# EAGLE design hexapod_mk2_leg_v0.0 (EAGLE 9.6.2)
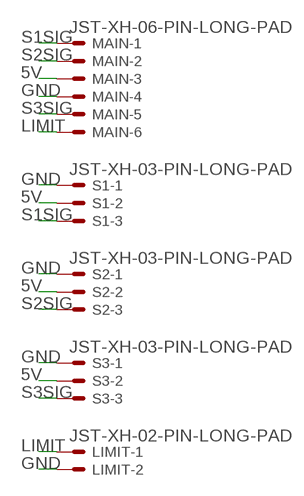
[diagram p0: schematic, sheet 1]

## Parts
LIMIT  JST-XH-02-PIN-LONG-PAD  [JST-XH-02-PACKAGE-LONG-PAD]
MAIN  JST-XH-06-PIN-LONG-PAD  [JST-XH-06-PACKAGE-LONG-PAD]
S1  JST-XH-03-PIN-LONG-PAD  [JST-XH-03-PACKAGE-LONG-PAD]
S2  JST-XH-03-PIN-LONG-PAD  [JST-XH-03-PACKAGE-LONG-PAD]
S3  JST-XH-03-PIN-LONG-PAD  [JST-XH-03-PACKAGE-LONG-PAD]

## Nets
5V: MAIN.3 S1.2 S2.2 S3.2
GND: LIMIT.2 MAIN.4 S1.1 S2.1 S3.1
LIMIT: LIMIT.1 MAIN.6
S1SIG: MAIN.1 S1.3
S2SIG: MAIN.2 S2.3
S3SIG: MAIN.5 S3.3

## Library data of the parts
LIMIT = Rembrandt Electronics - JST XH Connectors v1-0:JST-XH-02-PIN: JST XH Connector 2 Pin Wire to board connector. Pitch: 2,54 mm, (0.100") Number of pins: 2 Created by Rembrandt Electronics www.rembrandtelectronics.com
MAIN = Rembrandt Electronics - JST XH Connectors v1-0:JST-XH-06-PIN: JST XH Connector 2 Pin Wire to board connector. Pitch: 2,54 mm, (0.100") Number of pins: 6 Created by Rembrandt Electronics www.rembrandtelectronics.com
S1-S3 = Rembrandt Electronics - JST XH Connectors v1-0:JST-XH-03-PIN: JST XH Connector 2 Pin Wire to board connector. Pitch: 2,54 mm, (0.100") Number of pins: 3 Created by Rembrandt Electronics www.rembrandtelectronics.com

## Board
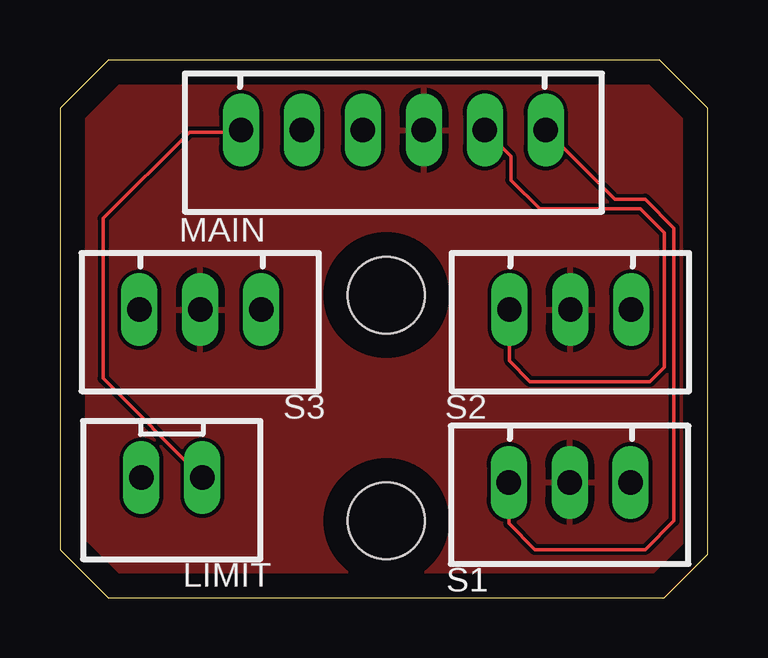
[diagram p1: board, top side]
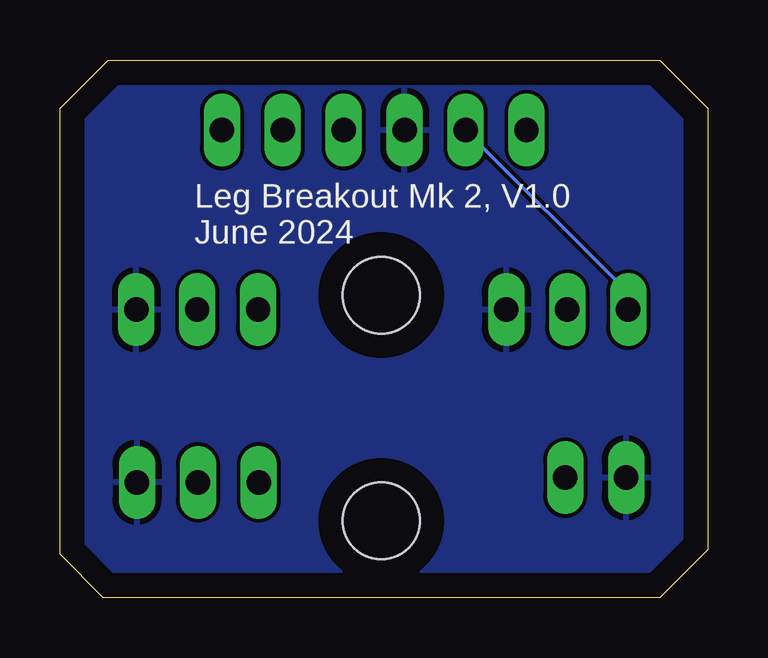
[diagram p2: board, bottom side, seen from below]

Size 27 x 22.4 mm. Coordinates in mm from the lower left corner, seen from the top.
Outline: 0,20.4 0,2 2,0 25.2,0 27,1.8 27,20.4 25,22.4 2,22.4 0,20.4
Copper layers (1*16): Top 0.035mm / dielectric 1.5mm / Bottom 0.035mm
Design rules "default": minimum track width 6mil, minimum drill 0.35mm, track to track 6mil, track to pad 6mil, pad to pad 6mil, via to via 6mil, smd to smd 6mil, copper to edge 40mil, drill to drill 6mil, minimum pad ring 10mil, minimum via ring 8mil, stop-mask expansion 4mil, vias tented up to drill 0mil, thermal gap 10mil
Holes 3.2 mm at 13.6,12.6 13.6,3.2

### Footprints (pad centres in the part's own frame; a part is rotated, then mirrored left to right if it is on the bottom)
JST-XH-02-PACKAGE-LONG-PAD = drill 1.016 long: 1 -1.27,0; 2 1.27,0
JST-XH-06-PACKAGE-LONG-PAD = drill 1.016 long: 1 -6.35,0; 2 -3.81,0; 3 -1.27,0; 4 1.27,0; 5 3.81,0; 6 6.35,0
JST-XH-03-PACKAGE-LONG-PAD = drill 1.016 long: 1 -2.54,0; 2 0,0; 3 2.54,0

### Placement (x,y rotation side)
LIMIT  4.66,5 180 top
MAIN  13.9,19.48 180 top
S1  21.25,4.8 180 top
S2  21.28,12 180 top
S3  5.85,12 180 top

### Tracks (layer width: path | path; a pad name or v marks a point on that pad's centre or on a via)
5V
  pour Top: 0.2,22 26.4,22 26.6,21.8 26.6,0.4 1,0.4 0.8,0.6 0.8,21.4
GND
  pour Bottom: 0.6,22.4 26.2,22.4 26.6,22 26.6,0.4 26.2,0 1.2,0 0.8,0.4 0.8,22.2
LIMIT
  Top 0.152: MAIN.6 7.47,19.4 5.4,19.4 1.8,15.8 1.8,9.13 LIMIT.1
S1SIG
  Top 0.152: MAIN.1 23.13,16.6 24.4,16.6 25.6,15.4 25.6,3.2 24.4,2 19.8,2 18.71,3.09 S1.3
S2SIG
  Top 0.152: MAIN.2 18.8,18.39 18.8,17.4 20,16.2 24.2,16.2 25.2,15.2 25.2,9.6 24.6,9 19.6,9 18.74,9.86 S2.3
S3SIG
  Bottom 0.152: S3.3 3.31,12.7 MAIN.5

### Text on the board
tPlace: ⏚ | ⏚ | ⏚ | ⏚ | ⏚
bPlace: Leg Breakout Mk 2, V1.0 / June 2024